# EAGLE design pcb_univ_3-8-0-x-rev3 (EAGLE 7.3.0)
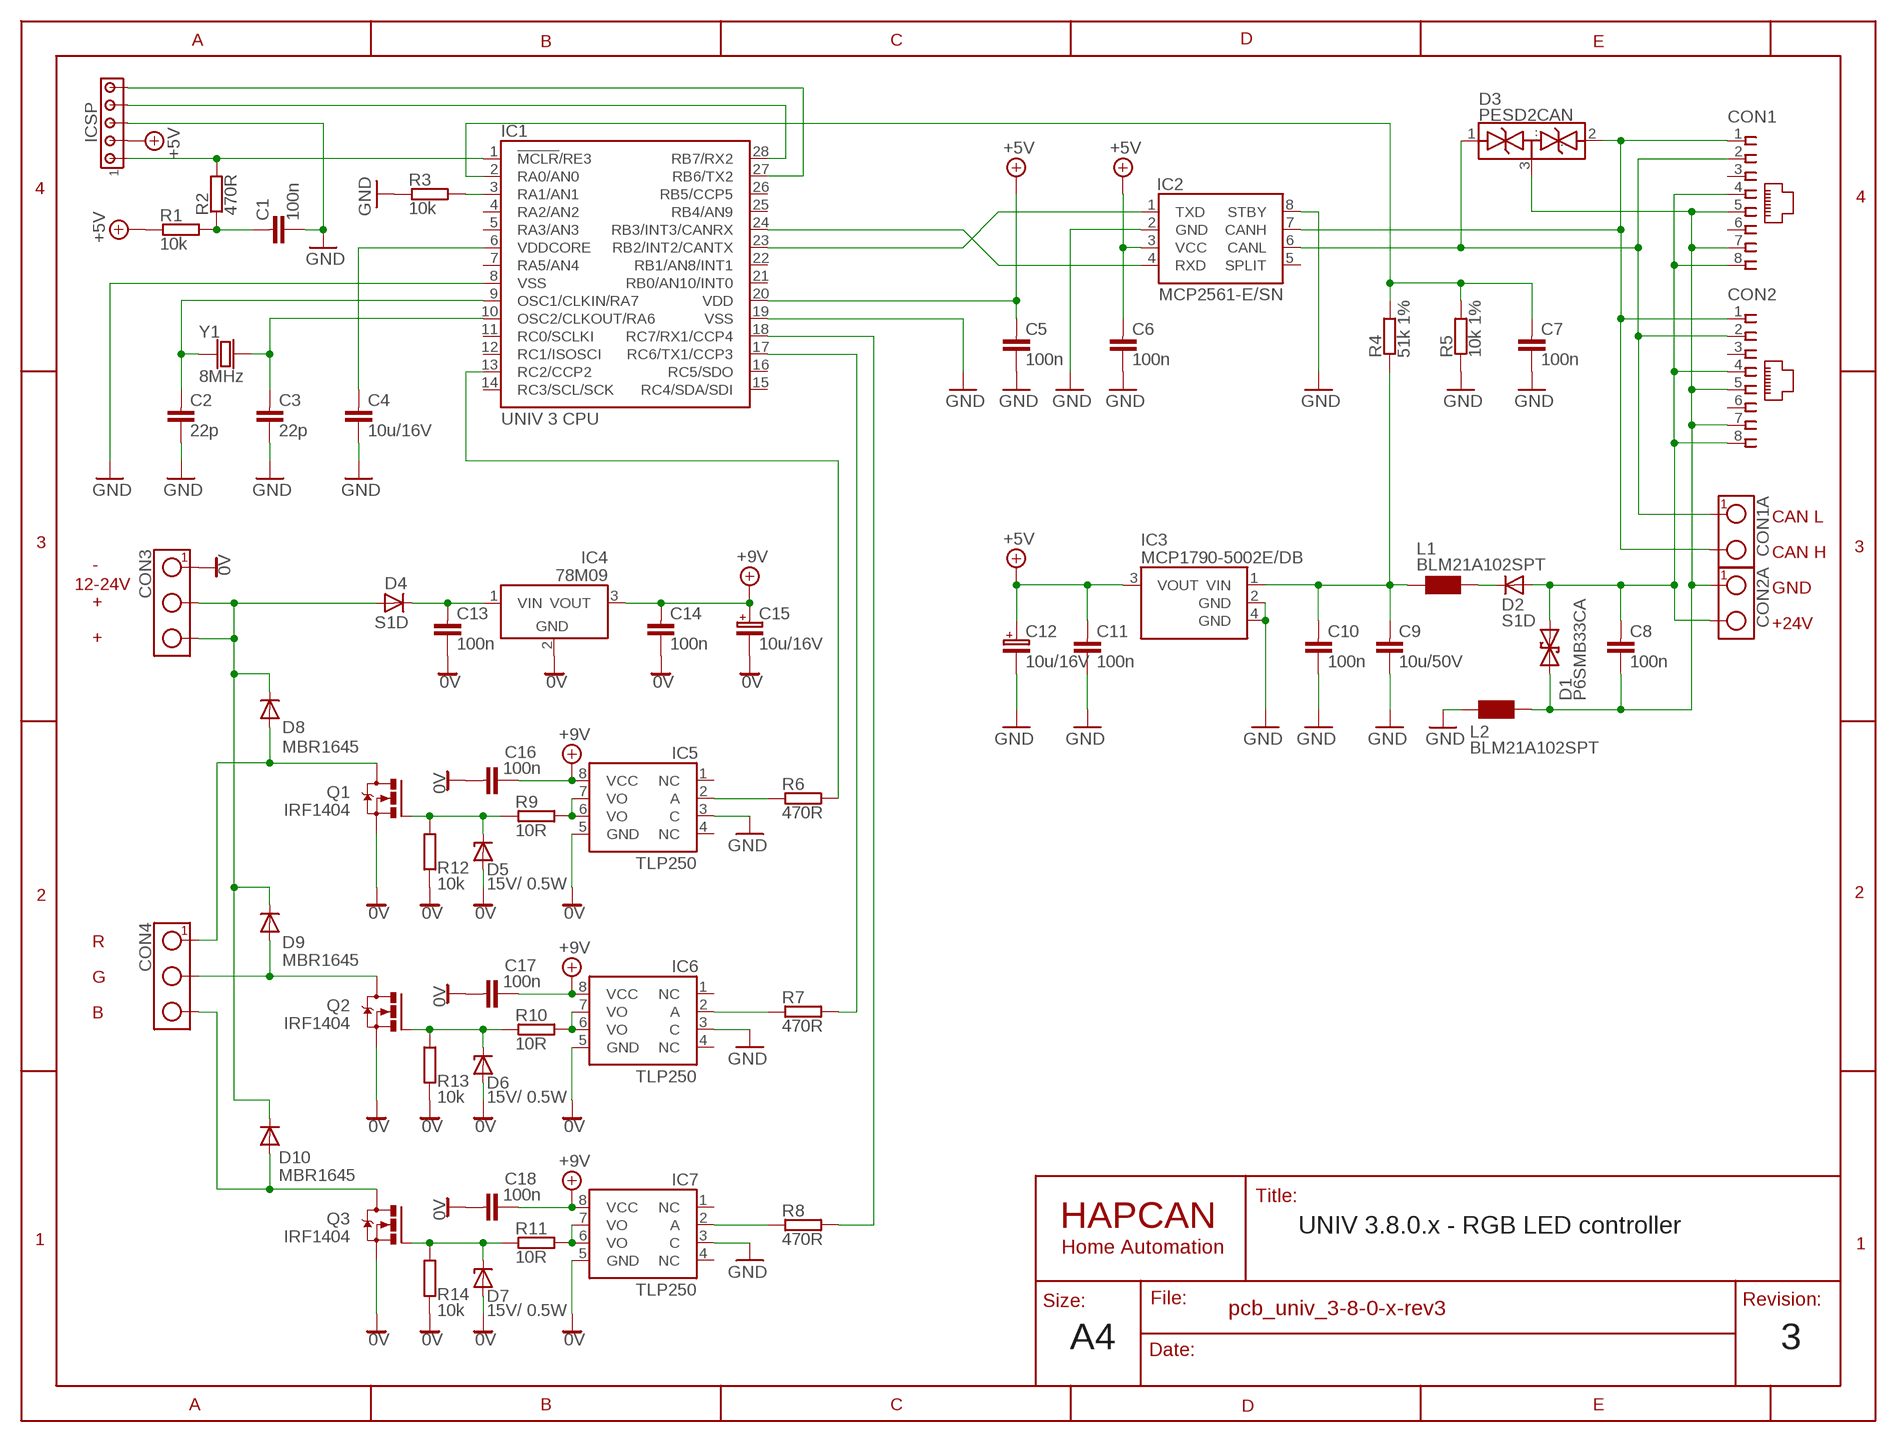
[diagram p0: schematic, sheet 1]

## Parts
C1  100n  CAPACITOR0805  [0805]
C2  22p  CAPACITOR0805  [0805]
C3  22p  CAPACITOR0805  [0805]
C4  10u/16V  CAPACITOR0805  [0805]
C5  100n  CAPACITOR0805  [0805]
C6  100n  CAPACITOR0805  [0805]
C7  100n  CAPACITOR0805  [0805]
C8  100n  CAPACITOR0805  [0805]
C9  10u/50V  CAPACITOR1210  [1210]
C10  100n  CAPACITOR0805  [0805]
C11  100n  CAPACITOR0805  [0805]
C12  10u/16V  CAPACITOR-POLARIZED-SMC_B  [SMC_B]
C13  100n  CAPACITOR0805  [0805]
C14  100n  CAPACITOR0805  [0805]
C15  10u/16V  CAPACITOR-POLARIZED-SMC_B  [SMC_B]
C16  100n  CAPACITOR0805  [0805]
C17  100n  CAPACITOR0805  [0805]
C18  100n  CAPACITOR0805  [0805]
CON1  RJ45-SOCKET  [RJ45-PCB-SOCKET]
CON1A  TERMINAL-2  TERMINAL-2-5X10,5MM  [ARK2-5X10,5MM]
CON2  RJ45-SOCKET  [RJ45-PCB-SOCKET]
CON2A  TERMINAL-2  TERMINAL-2-5X10,5MM  [ARK2-5X10,5MM]
CON3  TERMINAL-3  TERMINAL-3-5X10.5MM  [ARK3-5X10.5MM]
CON4  TERMINAL-3  TERMINAL-3-5X10.5MM  [ARK3-5X10.5MM]
D1  P6SMB33CA  DIODE_TRANSIL2  [DO-214_TRANSIL2]
D2  S1D  DIODE_DO-214  [DO-214]
D3  PESD2CAN  PESD2CANSOT-23  [SOT-23]
D4  S1D  DIODE_DO-214  [DO-214]
D5  15V/ 0.5W  DIODE_ZENER_SOD-80  [SOD-80]
D6  15V/ 0.5W  DIODE_ZENER_SOD-80  [SOD-80]
D7  15V/ 0.5W  DIODE_ZENER_SOD-80  [SOD-80]
D8  MBR1645  DIODE_TO220V  [TO220V-2]
D9  MBR1645  DIODE_TO220V  [TO220V-2]
D10  MBR1645  DIODE_TO220V  [TO220V-2]
IC1  UNIV 3 CPU  UNIV3CPU  [UNIV3CPU]
IC2  MCP2561-E/SN  [SO-08]
IC3  MCP1790-5002E/DB  MCP1790  [SOT-223]
IC4  78M09  78XX_TO-252  [TO-252]
IC5  TLP250  TLP250_WIDE  [DIL-08W]
IC6  TLP250  TLP250_WIDE  [DIL-08W]
IC7  TLP250  TLP250_WIDE  [DIL-08W]
ICSP  HEADER5  [SIP-5]
L1  BLM21A102SPT  CHOKE0805  [0805]
L2  BLM21A102SPT  CHOKE0805  [0805]
Q1  IRF1404  TRANSISTOR_MOSFET_N_TO220V  [TO220V]
Q2  IRF1404  TRANSISTOR_MOSFET_N_TO220V  [TO220V]
Q3  IRF1404  TRANSISTOR_MOSFET_N_TO220V  [TO220V]
R1  10k  RESISTOR0805  [0805]
R2  470R  RESISTOR0805  [0805]
R3  10k  RESISTOR0805  [0805]
R4  51k 1%  RESISTOR0805  [0805]
R5  10k 1%  RESISTOR0805  [0805]
R6  470R  RESISTOR0805  [0805]
R7  470R  RESISTOR0805  [0805]
R8  470R  RESISTOR0805  [0805]
R9  10R  RESISTOR0805  [0805]
R10  10R  RESISTOR0805  [0805]
R11  10R  RESISTOR0805  [0805]
R12  10k  RESISTOR0805  [0805]
R13  10k  RESISTOR0805  [0805]
R14  10k  RESISTOR0805  [0805]
Y1  8MHz  CRYSTAL-HC49V  [CRYSTAL-HC49V]

## Nets
0V: C13.2 C14.2 C15.- C16.1 C17.1 C18.1 CON3.1 D5.A D6.A D7.A IC4.2(GND) IC5.5(GND) IC6.5(GND) IC7.5(GND) Q1.3(S) Q2.3(S) Q3.3(S) R12.1 R13.1 R14.1
+5V: C5.1 C6.1 C11.1 C12.+ IC1.20(VDD) IC2.3(VCC) IC3.3(VOUT) ICSP.2 R1.1
+9V: C14.1 C15.+ C16.2 C17.2 C18.2 IC4.3(VOUT) IC5.8(VCC) IC6.8(VCC) IC7.8(VCC)
GND: C1.2 C2.2 C3.2 C4.2 C5.2 C6.2 C7.2 C9.2 C10.2 C11.2 C12.- IC1.8(VSS) IC1.19(VSS) IC2.2(GND) IC2.8(STBY) IC3.2(GND) IC3.4(GND) IC5.3(C) IC6.3(C) IC7.3(C) ICSP.3 L2.1 R3.1 R5.1
N$1: CON3.2 CON3.3 D4.A D8.1(C) D9.1(C) D10.1(C)
N$2: IC1.24(RB3/INT3/CANRX) IC2.4(RXD)
N$3: IC1.23(RB2/INT2/CANTX) IC2.1(TXD)
N$4: CON1.1 CON1A.2 CON2.1 D3.2(..) IC2.7(CANH)
N$5: IC5.6(VO) IC5.7(VO) R9.2
N$6: IC6.6(VO) IC6.7(VO) R10.2
N$7: C1.1 R1.2 R2.1
N$8: IC1.1(!MCLR!/RE3) ICSP.1 R2.2
N$9: C8.1 CON1.4 CON1.8 CON2.4 CON2.8 CON2A.2 D1.C D2.A
N$10: IC1.28(RB7/RX2) ICSP.4
N$11: IC6.2(A) R7.1
N$12: IC1.3(RA1/AN1) R3.2
N$13: C13.1 D4.C IC4.1(VIN)
N$14: IC1.27(RB6/TX2) ICSP.5
N$15: C3.1 IC1.10(OSC2/CLKOUT/RA6) Y1.2
N$16: C7.1 IC1.2(RA0/AN0) R4.2 R5.2
N$17: C9.1 C10.1 IC3.1(VIN) L1.1 R4.1
N$18: IC5.2(A) R6.1
N$19: IC1.13(RC2/CCP2) R6.2
N$20: IC1.17(RC6/TX1/CCP3) R7.2
N$21: IC1.18(RC7/RX1/CCP4) R8.2
N$22: C8.2 CON1.5 CON1.7 CON2.5 CON2.7 CON2A.1 D1.A D3.3(...) L2.2
N$24: CON4.2 D9.3(A) Q2.2(D)
N$26: D6.C Q2.1(G) R10.1 R13.2
N$27: CON1.2 CON1A.1 CON2.2 D3.1(.) IC2.6(CANL)
N$28: IC7.6(VO) IC7.7(VO) R11.2
N$29: IC7.2(A) R8.1
N$30: D5.C Q1.1(G) R9.1 R12.2
N$32: CON4.1 D8.3(A) Q1.2(D)
N$33: CON4.3 D10.3(A) Q3.2(D)
N$34: D7.C Q3.1(G) R11.1 R14.2
N$40: C2.1 IC1.9(OSC1/CLKIN/RA7) Y1.1
N$56: C4.1 IC1.6(VDDCORE)
N$67: D2.C L1.2
Unconnected: CON1.3 CON1.6 CON2.3 CON2.6 IC1.4(RA2/AN2) IC1.5(RA3/AN3) IC1.7(RA5/AN4) IC1.11(RC0/SCLKI) IC1.12(RC1/ISOSCI) IC1.14(RC3/SCL/SCK) IC1.15(RC4/SDA/SDI) IC1.16(RC5/SDO) IC1.21(RB0/AN10/INT0) IC1.22(RB1/AN8/INT1) IC1.25(RB4/AN9) IC1.26(RB5/CCP5) IC2.5(SPLIT) IC5.1(NC) IC5.4(NC) IC6.1(NC) IC6.4(NC) IC7.1(NC) IC7.4(NC)

## Notes on the sheet
- CAN L
- CAN H
- -
- 12-24V | GND
- +
- +24V
- +
- R
- G
- B
- UNIV 3.8.0.x - RGB LED controller
- A4 | 3

## Library data of the parts
C1-C11 C13 C14 C16-C18 = HAPCAN_devices - UNIV3:CAPACITOR: HAPCAN Capacitor
C12 C15 = HAPCAN_devices - UNIV3:CAPACITOR-POLARIZED: HAPCAN Polarazied Capacitor
CON1 CON2 = HAPCAN_devices - UNIV3:RJ45-SOCKET: HAPCAN RJ45 socket
CON1A CON2A = HAPCAN_devices - UNIV3:TERMINAL-2: HAPCAN Terminal Block - 2 way
CON3 CON4 = HAPCAN_devices - UNIV3:TERMINAL-3: HAPCAN Terminal Block - 3 way
D1 = HAPCAN_devices - UNIV3-eagle5:DIODE_TRANSIL2: HAPCAN Bidirectional transil diode
D2 D4 D8-D10 = HAPCAN_devices - UNIV3:DIODE: HAPCAN Rectifier Diode
D3 = HAPCAN_devices - UNIV3:PESD2CAN: CAN bus ESD protection diode
D5-D7 = HAPCAN_devices - UNIV3:DIODE_ZENER: HAPCAN ZENER DIODE
IC1 = HAPCAN_devices - UNIV3-eagle5:UNIV3CPU: HAPCAN Microcontroller UNIV 3 CPU
IC2 = HAPCAN_devices - UNIV3:MCP2561: HAPCAN CAN Tranceiver
IC3 = HAPCAN_devices - UNIV3:MCP1790: 70 mA, High Voltage Regulator
IC4 = HAPCAN_devices - UNIV3:78XX: HAPCAN positive voltage regulator
IC5-IC7 = HAPCAN_devices - UNIV3:TLP250: TLP250
ICSP = HAPCAN_devices - UNIV3:HEADER5: HAPCAN Header 5
L1 L2 = HAPCAN_devices - UNIV3:CHOKE: Choke
Q1-Q3 = HAPCAN_devices - UNIV3:TRANSISTOR_MOSFET_N: HAPCAN N-MOSFET
R1-R14 = HAPCAN_devices - UNIV3:RESISTOR: HAPCAN Resistor
Y1 = HAPCAN_devices - UNIV3:CRYSTAL: HAPCAN Crystal

## Board
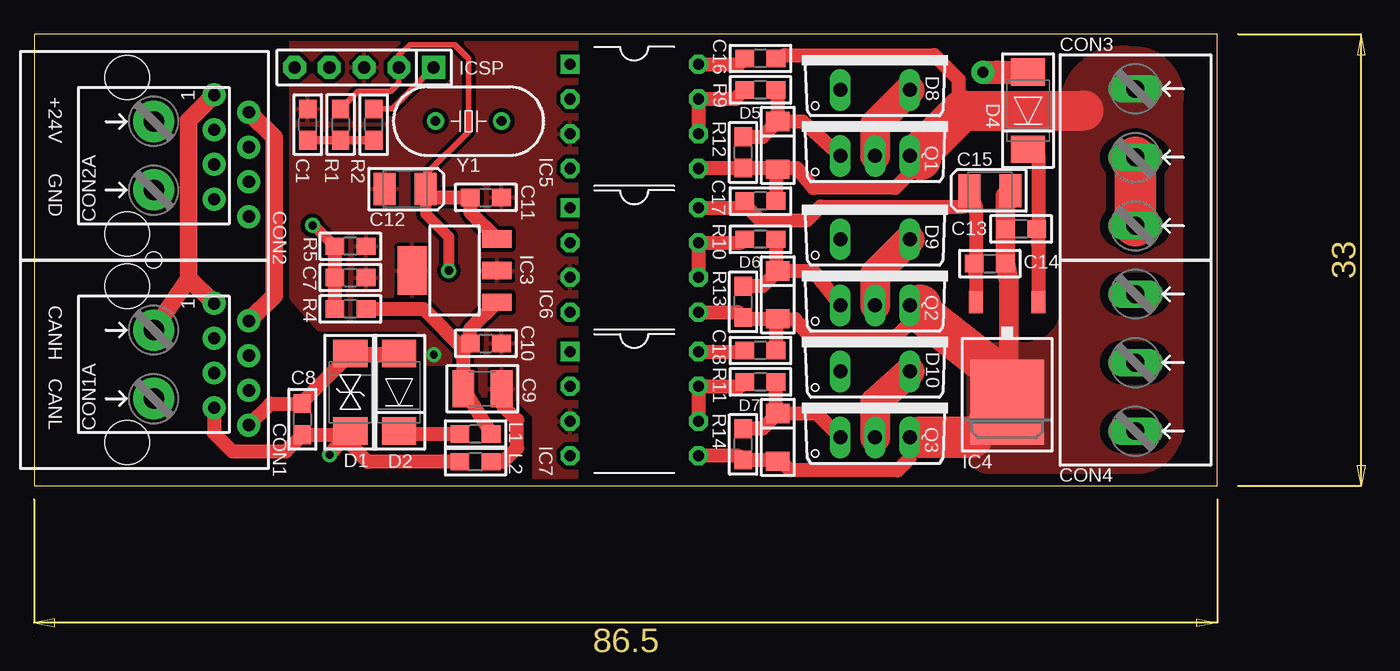
[diagram p1: board, top side]
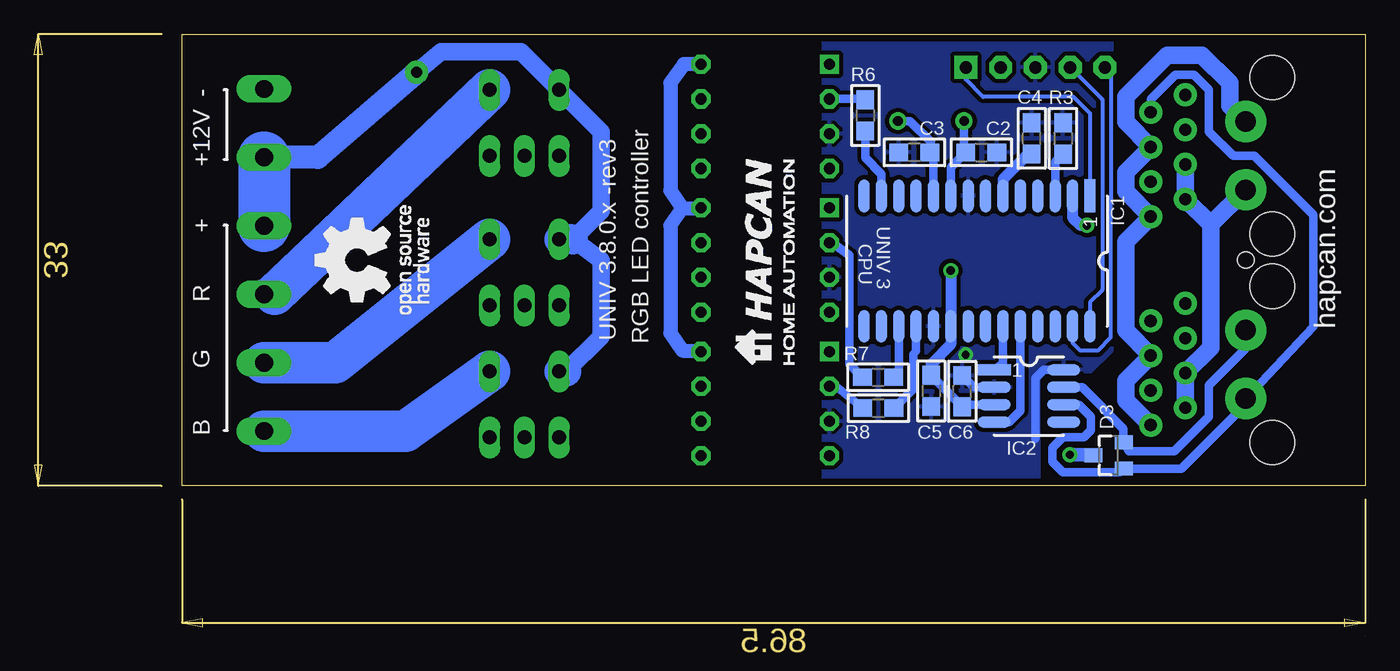
[diagram p2: board, bottom side, seen from below]

Size 86.5 x 44 mm. Coordinates in mm from the lower left corner, seen from the top.
Outline: 0,0.01 0,0
Outline: 0,1 0,10
Outline: 0,44 0,11 86.5,11 86.5,44 0,44
Copper layers (1*16): Top 0.035mm / dielectric 1.5mm / Bottom 0.035mm
Design rules "HAPCAN-Drc *": minimum track width 12mil, minimum drill 0.5mm, track to track 12mil, track to pad 12mil, pad to pad 12mil, via to via 12mil, smd to smd 10mil, copper to edge 20mil, drill to drill 8mil, minimum pad ring 10mil, minimum via ring 10mil, stop-mask expansion 4mil, vias tented up to drill 0mil, thermal gap 10mil
Holes 1.2 mm at 8.74,27.5
tKeepout: 4 lines

### Footprints (pad centres in the part's own frame; a part is rotated, then mirrored left to right if it is on the bottom)
0805 = smd 1.372 x 1.27: 1 -1.143,0; 2 1.143,0
1210 = smd 1.6 x 2.7: 1 -1.4,0; 2 1.4,0
SMC_B = smd 1.6 x 2.4: + -1.5,0; - 1.5,0
RJ45-PCB-SOCKET = drill 0.9 pad 1.676: 1 -4.445,6.35; 2 -3.175,8.89; 3 -1.905,6.35; 4 -0.635,8.89; 5 0.635,6.35; 6 1.905,8.89; 7 3.175,6.35; 8 4.445,8.89 | hole 3.251: -5.715,0; 5.715,0
ARK2-5X10,5MM = drill 1.5 pad 3: 1 -2.5,0; 2 2.5,0
ARK3-5X10.5MM = drill 1.3 pad 2 long: 1 -5,0; 2 0,0; 3 5,0
DO-214_TRANSIL2 = smd 2 x 2.5: A 2.82,0; C -2.82,0
DO-214 = smd 2 x 2.5: A 2.82,0; C -2.82,0
SOT-23 = smd 1.016 x 1.321: 1 -0.965,-1.118; 2 0.965,-1.118; 3 0,1.118
SOD-80 = smd 1.4 x 1.7: A 1.75,0; C -1.75,0
TO220V-2 = drill 1.016 long: 1 -2.54,0; 3 2.54,0
UNIV3CPU = smd 2.4 x 0.8: 1 -4.763,8.255; 2 -4.763,6.985; 3 -4.763,5.715; 4 -4.763,4.445; 5 -4.763,3.175; 6 -4.763,1.905; 7 -4.763,0.635; 8 -4.763,-0.635; 9 -4.763,-1.905; 10 -4.763,-3.175; 11 -4.763,-4.445; 12 -4.763,-5.715; 13 -4.763,-6.985; 14 -4.763,-8.255; 15 4.763,-8.255; 16 4.763,-6.985; 17 4.763,-5.715; 18 4.763,-4.445; 19 4.763,-3.175; 20 4.763,-1.905; 21 4.763,-0.635; 22 4.763,0.635; 23 4.763,1.905; 24 4.763,3.175; 25 4.763,4.445; 26 4.763,5.715; 27 4.763,6.985; 28 4.763,8.255
SO-08 = smd 2.4 x 0.8: 1 -2.54,1.905; 2 -2.54,0.635; 3 -2.54,-0.635; 4 -2.54,-1.905; 5 2.54,-1.905; 6 2.54,-0.635; 7 2.54,0.635; 8 2.54,1.905
SOT-223 = smd 1.27 x 2.159: 1 -2.311,-3.099; 2 0,-3.099; 3 2.311,-3.099 | smd 3.556 x 2.159: 4 0,3.099
TO-252 = smd 1 x 1.6: 1 -2.28,-4.8; 3 2.28,-4.8 | smd 5.4 x 6.2: 2 0,2.5
DIL-08W = drill 0.813 pad 1.4 square: 1 -3.81,-4.7 | drill 0.813 pad 1.4 octagon: 2 -1.27,-4.7; 3 1.27,-4.7; 4 3.81,-4.7; 5 3.81,4.7; 6 1.27,4.7; 7 -1.27,4.7; 8 -3.81,4.7
SIP-5 = drill 0.9 pad 1.676 square: 1 -5.08,0 | drill 0.9 pad 1.676 octagon: 2 -2.54,0; 3 0,0; 4 2.54,0; 5 5.08,0
TO220V = drill 1.016 long: 1 -2.54,0; 2 0,0; 3 2.54,0
CRYSTAL-HC49V = drill 0.7 pad 1.27: 1 -2.413,0; 2 2.413,0

### Placement (x,y rotation side)
C1  19.99,37.39 90 top
C2  28.07,35.36 0 bottom
C3  32.96,35.36 180 bottom
C4  24.38,36.39 90 bottom
C5  31.72,17.93 270 bottom
C6  29.46,17.91 90 bottom
C7  23.11,26.22 0 top
C8  19.61,15.87 270 top
C9  32.77,18.09 0 top
C10  33.02,21.41 0 top
C11  33.02,32.07 0 top
C12  27.11,32.69 180 top
C13  72.14,29.78 180 top
C14  69.85,27.24 0 top
C15  69.85,32.57 0 top
C16  53.09,42.22 180 top
C17  53.09,31.81 180 top
C18  53.09,20.89 180 top
CON1  6.8,19.88 270 top
CON1A  8.74,19.88 90 top
CON2  6.8,35.12 270 top
CON2A  8.74,35.12 90 top
CON3  80.5,35 270 top
CON4  80.5,20 270 top
D1  23.11,17.84 270 top
D2  26.67,17.84 90 top
D3  18.77,13.23 90 bottom
D4  72.64,38.41 90 top
D5  54.36,35.87 270 top
D6  54.36,24.95 270 top
D7  54.36,14.54 270 top
D8  61.47,39.94 0 top
D9  61.47,29.01 0 top
D10  61.47,19.36 0 top
IC1  28.39,27.42 270 bottom
IC2  24.58,17.57 0 bottom
IC3  30.73,26.73 90 top
IC4  71.12,19.62 180 top
IC5  43.86,38 270 top
IC6  43.86,27.5 270 top
IC7  43.86,17 270 top
ICSP  24.11,41.58 180 top
L1  32.26,14.79 180 top
L2  32.26,12.76 180 top
Q1  61.47,35.11 0 top
Q2  61.47,24.19 0 top
Q3  61.47,14.54 0 top
R1  22.4,37.4 270 top
R2  24.82,37.39 90 top
R3  22.1,36.38 270 bottom
R4  23.11,23.93 180 top
R5  23.11,28.51 180 top
R6  36.55,38.06 270 bottom
R7  35.61,18.93 0 bottom
R8  35.59,16.68 0 bottom
R9  53.09,39.94 180 top
R10  53.09,29.01 180 top
R11  53.09,18.6 180 top
R12  51.82,35.36 90 top
R13  51.82,24.44 90 top
R14  51.82,14.03 90 top
Y1  31.75,37.65 0 top

### Tracks (layer width: path | path; a pad name or v marks a point on that pad's centre or on a via)
0V
  Top 0.406: D5.A 54.38,34.09
  Top 0.813: Q3.3 64.01,13.01 | 64.01,22.92 Q2.3
  Top 1.016: IC5.5 51.78,34.19 R12.1 54.26,34.22 | 54.26,34.22 D5.A 54.23,34.12 C17.1 | D6.A 51.91,23.2 R13.1 51.42,23.69 IC6.5 | IC7.5 51.51,13.19 R14.1 54.26,12.88 | 54.26,12.88 D7.A | D6.A 54.38,23.17 55.63,23.17 56.77,21.77 62.87,21.77 64.01,22.92 | 64.01,23.43 64.26,23.43 64.77,23.93 | 54.26,34.22 55.75,34.22 56.95,32.77 62.94,32.77 64.01,33.84 Q1.3 | C18.1 54.23,23.07 D6.A | C16.1 54.1,42.22 54.86,42.48 65.79,42.48 67.56,40.7 67.56,38.67 67.82,38.41 | 54.26,12.88 54.48,12.88 55.24,12.12 63.12,12.12 64.01,13.01
  Top 1.27: 64.77,14.54 Q3.3 | Q2.3 64.77,24.19 | 64.77,34.86 Q1.3
  Top 1.422: C15.- 70.99,32.21 C13.2 C14.2 71.25,25.97 71.25,19.13 arc-90 71.23,18.6
  Top 2.54: 69.34,20.38 71.88,18.35 | IC4.2 68.54,14.54
  Top 2.921: 67.82,38.41 76.71,38.41
  Top 3.048: 64.77,24.19 64.77,23.93 64.77,23.68 71.23,18.6 71.88,18.09 IC4.2 | 64.77,34.86 64.77,35.36 67.82,38.41 | 68.54,14.54 64.77,14.54
  pour Top (isolate 0.61, no thermals): 80.77,42.98 arc-90 83.82,38.92 83.82,15.55 arc-90 80.77,12 69.85,12 arc-90 68.33,13.52 68.33,18.85 arc-90 70.61,21.39 72.39,21.39 arc90 75.18,23.93 75.18,39.43 arc-90 80.26,42.98
+5V  (via drill 0.6)
  Top 0.406: C12.+ 28.61,33.75 31.75,36.89 31.75,42.22 30.73,43.24 27.43,43.24 26.65,42.46 ICSP.2 26.65,40.43 26.06,39.83 23.69,39.83 R1.1
  Top 0.813: C12.+ 28.61,30.88 30.3,29.19 v30.3,26.73
  Top 1.016: C12.+ 29.23,32.07 C11.1 31.88,31 IC3.3
  Bottom 0.61: IC2.3 29.3,16.93 C6.1 31.72,19.03 C5.1 31.72,19.9
  Bottom 0.813: 31.72,19.9 30.29,21.33 IC1.20 30.29,26.72 v30.3,26.73
+9V
  Top 0.61: C15.+ 68.73,31.93
  Top 0.813: C17.2 51.94,31.76 | 68.35,31.55 C15.+ | 53.09,30.41 55.24,30.41
  Top 1.016: 52.19,31.31 C17.2 | IC6.8 52.19,31.31 | IC4.3 68.84,26.1 C14.1 68.83,26.86 68.83,31.05 68.86,31.28 C15.+ | C16.2 51.53,41.81 IC5.8 | C18.2 51.87,20.81 IC7.8 | 52.19,31.31 53.09,30.41 | 68.35,31.55 67.92,31.4 57.48,31.4 56.49,30.41 55.24,30.41
  Bottom 1.016: IC7.8 48.76,20.89 49.91,20.89 50.8,22.16 50.8,30.03 49.91,31.3 | 49.91,31.3 48.69,31.3 IC6.8 | IC5.8 49.81,41.81 50.8,40.44 50.8,32.57 49.91,31.3
GND  (via drill 0.56)
  Top 1.016: C9.2 34.29,17.97 34.29,16.82 35.31,15.81 35.31,13.77 34.29,12.76 L2.1
  Bottom 0.61: IC2.2 28.61,18.2 C6.2 | IC2.8 23.51,19.47 24.13,18.85 24.13,14.45
  other vias: 29.21,20.58
  pour Top (isolate 0.305): 39.62,44 39.62,10.98 36.58,10.98 36.58,16.06 35.05,17.58 31.75,17.58 30.99,19.87 28.7,19.87 28.7,21.65 27.94,22.41 20.83,22.41 18.8,24.7 18.8,44
  pour Bottom (isolate 0.305): 39.62,44 39.62,10.98 23.88,10.98 23.88,18.85 23.37,19.36 20.07,19.36 18.54,20.89 18.54,44
N$1  (via drill 0.8 pad 1.68)
  Top 1.676: D4.A 70.38,41.23 v69.34,41.21
  Top 3.048: CON3.2 CON3.3
  Bottom 1.27: 58.42,19.36 55.88,21.9 55.88,27.49 57.91,29.01 55.88,31.05 55.88,36.89 D8.1 61.72,42.73 67.56,42.73 v69.34,41.21
  Bottom 1.524: CON3.2 78.34,35
  Bottom 1.676: v69.34,41.21 76.56,35 CON3.2
  Bottom 2.184: 58.42,19.36 D10.1 | 57.91,29.01 D9.1
  Bottom 3.81: CON3.2 CON3.3
N$2
  Bottom 0.61: IC1.24 25.21,16.5 26.05,15.66 IC2.4
N$3
  Bottom 0.61: IC1.23 26.48,19.94 IC2.1
N$4
  Top 1.27: CON2.1 11.3,37.72 11.3,26.17 | 11.3,26.17 CON1.1 | CON1A.2 11.3,26.17
  Bottom 0.61: IC2.7 20.68,18.2 17.67,15.19 D3.2 17.27,13.52 13.97,13.52 11.43,16.06 11.43,18.35 8.74,21.04 CON1A.2
N$5
  Top 1.016: IC5.6 IC5.7 51.28,39.27 R9.2
N$6
  Top 1.016: IC6.6 IC6.7 51.7,28.77 R10.2
N$7
  Top 0.61: C1.1 20.25,36.25 R1.2 R2.1
N$8
  Top 0.406: ICSP.1 26.16,38.54 R2.2
  Bottom 0.305: IC1.1 20.13,38.22 21.34,39.43 27.94,39.43 29.21,40.7 29.21,41.56 ICSP.1
N$9
  Top 1.016: CON1.8 17.27,17.01 C8.1 19.61,17.15 D1.C D2.A
  Bottom 1.27: CON1.8 17.5,17.27 17.5,18.68 CON1.4 17.5,22.35 17.5,28.84 CON2.8 17.5,32.51 17.5,33.92 CON2.4 17.5,37.59 17.5,39.43 14.48,42.48 11.94,42.48 9.91,40.44 9.91,38.79 CON2A.2
N$10
  Bottom 0.305: IC1.28 20.13,24.4 19.23,25.31 19.23,39.23 ICSP.4
N$11
  Bottom 0.61: IC6.2 39,28.77 37.69,27.85 37.69,19.87 R7.1
N$12
  Bottom 0.61: IC1.3 22.67,34.66 R3.2
N$13
  Top 1.016: IC4.1 73.4,28.64 C13.1 73.41,29.39 73.41,35.08 D4.C
N$14
  Bottom 0.305: ICSP.5 18.59,41.59 18.62,21.83 19.56,20.89 20.83,20.89 21.38,21.44 IC1.27
N$15
  Bottom 0.61: IC1.10 31.56,35.11 C3.1 | C3.1 31.62,35.56 | Y1.2 33.27,37.65 31.75,36.13 31.75,35.43 C3.1
N$16  (via drill 0.6)
  Top 0.813: R5.2 20.37,30.11 v20.34,30.03
  Top 1.016: R5.2 C7.1 R4.2
  Bottom 0.813: IC1.2 21.4,30.6 20.83,30.03 v20.34,30.03
N$17
  Top 1.016: L1.1 C9.1 31.37,20.9 31.43,20.96 | 31.43,20.96 C10.1 31.88,22.46 IC3.1 | R4.1 28.45,23.93 31.43,20.96
N$18
  Bottom 0.61: IC5.2 36.61,39.27 R6.1
N$19
  Bottom 0.61: R6.2 36.55,34.96 35.37,33.78 IC1.13
N$20
  Bottom 0.61: IC1.17 34.1,19.55 R7.2
N$21
  Bottom 0.61: IC1.18 32.83,20.82 33.02,20.63 33.02,18.11 R8.2
N$22  (via drill 0.6 pad 1.02)
  Top 1.016: L2.2 24.38,12.76 23.11,14.03 D1.A | CON1.7 13.15,14.85 14.48,13.52 18.4,13.52 C8.2 22.82,14.73 D1.A | v21.59,13.27 D1.A
  Bottom 1.016: D3.3 v21.59,13.27
  Bottom 1.27: CON2.5 CON2.7 11.3,30.1 | 11.3,30.1 11.3,21.09 CON1.5 CON1.7 | CON2A.1 11.3,30.1
N$24
  Top 2.184: Q2.2 61.47,26.47 D9.3
  Bottom 3.048: CON4.2 75.31,20 D9.3
N$26
  Top 1.016: R10.1 54.23,26.83 D6.C | R13.2 53.24,25.59 D6.C | D6.C 56.92,26.7 Q2.1
N$27
  Top 1.27: CON2.2 17.53,36.46 17.53,24.89 CON1.2
  Bottom 0.61: CON2.2 15.69,39.23 13.87,41.05 12.55,41.05 11.43,39.94 11.43,36.89 9.65,35.11 8.13,35.11 3.81,30.79 3.81,22.63 CON1A.1 8.74,16.97 13.45,12.26 D3.1 17.95,12 22.1,12 22.86,12.76 22.86,13.77 22.1,14.54 20.57,14.54 20.07,15.04 20.07,16.06 20.94,16.93 IC2.6
N$28
  Top 1.016: IC7.6 IC7.7 51.61,18.27 R11.2
N$29
  Bottom 0.61: IC7.2 38.71,18.27 R8.1
N$30
  Top 0.406: D5.C 54.23,37.75
  Top 1.016: R9.1 54.36,39.81 D5.C | R12.2 53.24,36.51 D5.C | D5.C 56.16,37.62 Q1.1
N$32
  Top 2.184: Q1.2 61.47,37.4 D8.3
  Bottom 2.184: 79.71,25 CON4.1
  Bottom 3.048: D8.3 79.71,25
N$33
  Top 2.184: Q3.2 61.47,17.08 D10.3
  Bottom 3.048: CON4.3 70.15,15 D10.3
N$34
  Top 1.016: R11.1 54.23,16.41 D7.C | R14.2 53.24,15.17 D7.C | D7.C 57.18,16.29 Q3.1
N$40
  Bottom 0.61: IC1.9 30.29,34.28 C2.1 29.34,35.49 Y1.1
N$56
  Bottom 0.61: C4.1 24.52,35.36
  Bottom 0.813: C4.1 24.14,35.36 | IC1.6 26.48,33.39 24.52,35.36
N$67
  Top 1.016: D2.C 27.66,14.79 L1.2

### Text on the board
tPlace: +24V | GND | CANH | CANL
bPlace: - | RGB LED controller | UNIV 3.8.0.x -rev3 | hapcan.com | +12V | + | R | G | B